# Altium schematic sheet sch1.SchDoc
size A4
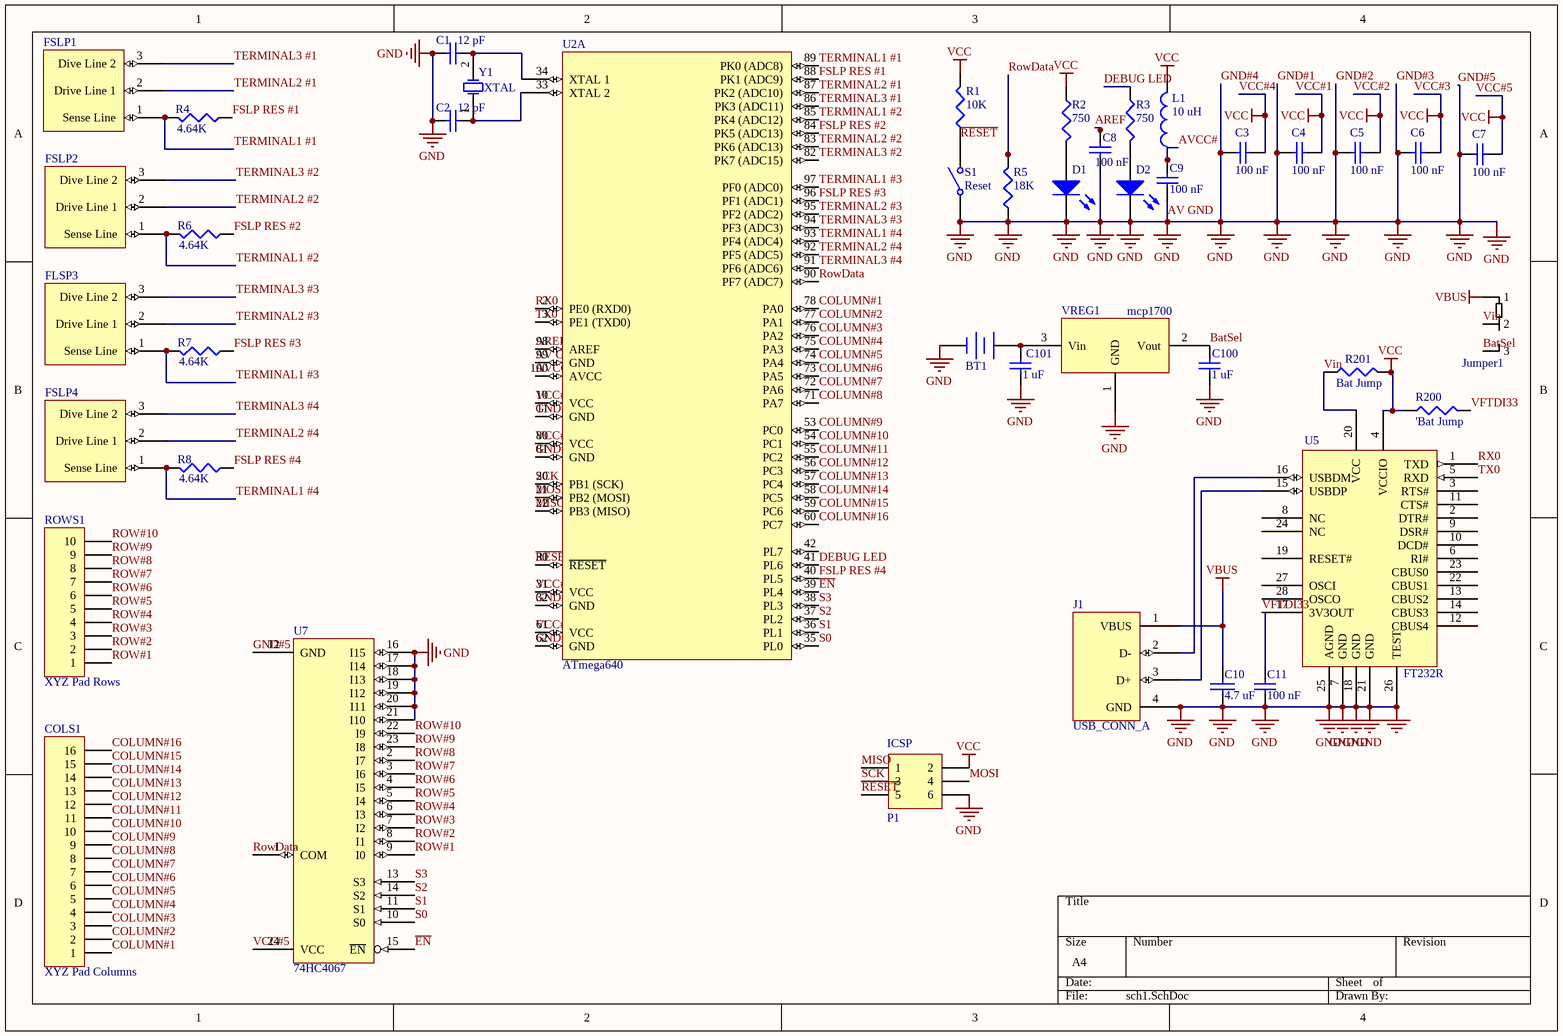
[diagram p0: sch1.SchDoc]

## Parts
BT1  Battery 3.7V Li-Ion  [BAT-2]  (value not drawn)
C1  12 pF  [0805]
C2  12 pF  [0805]
C3  100 nF  [1608[0603]]
C4  100 nF  [1608[0603]]
C5  100 nF  [1608[0603]]
C6  100 nF  [1608[0603]]
C7  100 nF  [1608[0603]]
C8  100 nF  [1608[0603]]
C9  100 nF  [1608[0603]]
C10  4.7 uF  [1608[0603]]
C11  100 nF  [1608[0603]]
C100  1 uF  [0805]
C101  1 uF  [0805]
COLS1  XYZ Pad Columns  [16 pin head]
D1  Power LED  [1608[0603]]  (value not drawn)
D2  Debug LED  [1608[0603]]  (value not drawn)
FLSP3  FSLP  [FSLP SMT connector]  (value not drawn)
FSLP1  FSLP  [FSLP SMT connector]  (value not drawn)
FSLP2  FSLP  [FSLP SMT connector]  (value not drawn)
FSLP4  FSLP  [FSLP SMT connector]  (value not drawn)
J1  USB_CONN_A  [USB_CONN_TYPEA_.9]
Jumper1  0-Ohm Jumper 0603  [0603-Jumper]  (value not drawn)
L1  10 uH  [1608[0603]]
P1  ICSP  [HDR2X3H]
R1  10K  [1608[0603]]
R2  750  [1608[0603]]
R3  750  [1608[0603]]
R4  4.64K  [1608[0603]]
R5  18K  [1608[0603]]
R6  4.64K  [1608[0603]]
R7  4.64K  [1608[0603]]
R8  4.64K  [1608[0603]]
R200  'Bat Jump  [J1-0603]
R201  Bat Jump  [J1-0603]
ROWS1  XYZ Pad Rows  [10 pin Head]
S1  Reset  [B3U-1000P]
U2  ATmega640  [100A_N]  (part A of 2)
U5  FT232R  [SSOP28]
U7  74HC4067  [74HC4067]
VREG1  mcp1700  [SOT-23]
Y1  XTAL  [crystal]

## Nets
AV GND: BT1.2(-) C1.2 C2.2 C3.2 C4.2 C5.2 C6.2 C7.2 C8.1 C9.1 C10.2 C11.1 C100.1 C101.1 D1.2(K) D2.2(K) J1.4(GND) P1.6 R5.1 S1.1(COMMON) U2.11(GND) U2.32(GND) U2.62(GND) U2.81(GND) U2.99(GND) U5.7(GND) U5.18(GND) U5.21(GND) U5.25(AGND) U5.26(TEST) U7.12(GND) U7.16(I15) U7.17(I14) U7.18(I13) U7.19(I12) U7.20(I11) U7.21(I10) VREG1.1(GND)  [also labelled GND, GND#1, GND#2, GND#3, GND#4, GND#5, VSS]
VBUS: C10.1 J1.1(VBUS) Jumper1.1
VCC#1: C3.1 C4.1 C5.1 C6.1 C7.1 L1.2 P1.2 R1.2 R2.1 R200.1 R201.2 U2.10(VCC) U2.31(VCC) U2.61(VCC) U2.80(VCC) U5.4(VCCIO) U7.24(VCC)  [also labelled VCC, VCC#2, VCC#3, VCC#4, VCC#5]
AREF: C8.2 U2.98(AREF)
AVCC#: C9.2 L1.1 U2.100(AVCC)
BatSel: C100.2 Jumper1.3 VREG1.2(Vout)
COLUMN#1: COLS1.1 U2.78(PA0)
COLUMN#2: COLS1.2 U2.77(PA1)
COLUMN#3: COLS1.3 U2.76(PA2)
COLUMN#4: COLS1.4 U2.75(PA3)
COLUMN#5: COLS1.5 U2.74(PA4)
COLUMN#6: COLS1.6 U2.73(PA5)
COLUMN#7: COLS1.7 U2.72(PA6)
COLUMN#8: COLS1.8 U2.71(PA7)
COLUMN#9: COLS1.9 U2.53(PC0)
COLUMN#10: COLS1.10 U2.54(PC1)
COLUMN#11: COLS1.11 U2.55(PC2)
COLUMN#12: COLS1.12 U2.56(PC3)
COLUMN#13: COLS1.13 U2.57(PC4)
COLUMN#14: COLS1.14 U2.58(PC5)
COLUMN#15: COLS1.15 U2.59(PC6)
COLUMN#16: COLS1.16 U2.60(PC7)
DEBUG LED: R3.1 U2.41(PL6)
~{EN}: U2.39(PL4) U7.15(~{EN})
FSLP RES #1: R4.1 U2.88(PK1_(ADC9))
FSLP RES #2: R6.1 U2.84(PK5_(ADC13))
FSLP RES #3: R7.1 U2.96(PF1_(ADC1))
FSLP RES #4: R8.1 U2.40(PL5)
MISO: P1.1 U2.22(PB3_(MISO))
MOSI: P1.4 U2.21(PB2_(MOSI))
~{RESET}: P1.5 R1.1 S1.2(NO) U2.30(~{RESET})
ROW#1: ROWS1.1 U7.9(I0)
ROW#2: ROWS1.2 U7.8(I1)
ROW#3: ROWS1.3 U7.7(I2)
ROW#4: ROWS1.4 U7.6(I3)
ROW#5: ROWS1.5 U7.5(I4)
ROW#6: ROWS1.6 U7.4(I5)
ROW#7: ROWS1.7 U7.3(I6)
ROW#8: ROWS1.8 U7.2(I7)
ROW#9: ROWS1.9 U7.23(I8)
ROW#10: ROWS1.10 U7.22(I9)
RowData: R5.2 U2.90(PF7_(ADC7)) U7.1(COM)
RX0: U2.2(PE0_(RXD0)) U5.1(TXD)
S0: U2.35(PL0) U7.10(S0)
S1: U2.36(PL1) U7.11(S1)
S2: U2.37(PL2) U7.14(S2)
S3: U2.38(PL3) U7.13(S3)
SCK: P1.3 U2.20(PB1_(SCK))
TERMINAL1 #1: FSLP1.1(Sense_Line) R4.2 U2.89(PK0_(ADC8))
TERMINAL1 #2: FSLP2.1(Sense_Line) R6.2 U2.85(PK4_(ADC12))
TERMINAL1 #3: FLSP3.1(Sense_Line) R7.2 U2.97(PF0_(ADC0))
TERMINAL1 #4: FSLP4.1(Sense_Line) R8.2 U2.93(PF4_(ADC4))
TERMINAL2 #1: FSLP1.2(Drive_Line_1) U2.87(PK2_(ADC10))
TERMINAL2 #2: FSLP2.2(Drive_Line_1) U2.83(PK6_(ADC13))
TERMINAL2 #3: FLSP3.2(Drive_Line_1) U2.95(PF2_(ADC2))
TERMINAL2 #4: FSLP4.2(Drive_Line_1) U2.92(PF5_(ADC5))
TERMINAL3 #1: FSLP1.3(Dive_Line_2) U2.86(PK3_(ADC11))
TERMINAL3 #2: FSLP2.3(Dive_Line_2) U2.82(PK7_(ADC15))
TERMINAL3 #3: FLSP3.3(Dive_Line_2) U2.94(PF3_(ADC3))
TERMINAL3 #4: FSLP4.3(Dive_Line_2) U2.91(PF6_(ADC6))
TX0: U2.3(PE1_(TXD0)) U5.5(RXD)
VFTDI33: C11.2 R200.2 U5.17(3V3OUT)
Vin: Jumper1.2 R201.1 U5.20(VCC)
NetBT1_1: BT1.1(+) C101.2 VREG1.3(Vin)
NetC1_1: C1.1 U2.34(XTAL_1) Y1.2(OSC2)
NetC2_1: C2.1 U2.33(XTAL_2) Y1.1(OSC1)
NetD1_1: D1.1(A) R2.2
NetD2_1: D2.1(A) R3.2
NetJ1_2: J1.2(D-) U5.16(USBDM)
NetJ1_3: J1.3(D+) U5.15(USBDP)

Not connected (* = marked no-connect by the designer): U2 42(PL7); U5 2(DTR#) 3(RTS#) 6(RI#) 8(NC) 9(DSR#) 10(DCD#) 11(CTS#) 12(CBUS4) 13(CBUS2) 14(CBUS3) 19(RESET#) 22(CBUS1) 23(CBUS0) 24(NC) 27(OSCI) 28(OSCO)

## Library data of the parts
BT1 = Battery: Multicell Battery; Published: 24-Mar-1999; LatestRevisionDate: 17-Jul-2002; LatestRevisionNote: Re-released for DXP Platform.; Publisher: Altium Limited
C1 C2 = Cap: Capacitor; Part Number: 311-1100-1-ND; Manufacturer: Yageo; Component: XTAL Caps; Supplier: Digikey; Digikey #: CC0805JRNPO9BN120; Unit Price: 0.07
C3-C9 C11 = Cap: Capacitor; Part Number: 311-1088-1-ND; Manufacturer #: CC0603KRX7R7BB104; Manufacturer: Yageo; Component: 0.1UF 16V 10%; Supplier: Digikey; Unit Price: 0.07
C10 = CAP: Capacitor; Part Number: 311-1521-1-ND; Component: 4.7UF 6.3V 10% Decoupling; Supplier: Digikey; Unit Price: 0.11
C100 C101 = Cap: Capacitor
COLS1 = Header 16: Header, 16-Pin; Component: 16 pin header; Unit Price: 0.00
D1 = LED3: Orange; Part Number: 475-2740-1-ND; Manufacturer #: LO L29K-H2K1-24-Z; Component: Orange Power LED 2 mA; Supplier: Digikey; Unit Price: 0.17
D2 = LED3: Orange; Part Number: 475-1196-1-ND; Manufacturer #: LY L29K-H1K2-26-Z; Component: Yellow debug LED 2 mA; Supplier: Digikey; Unit Price: 0.14
FLSP3 FSLP1 FSLP2 FSLP4 = FSLP: Manufacturer: Interlink Electronics; Part Number: 34-00003; Tail connector: 04FM-1.0SP-1.9-TF; Component: Side strip position & pressure sensor; Supplier: Digikey; Unit Price: 8.73
J1 = USB_CONN_A: Connector USB Type A; Component: USB Receptacle
L1 = Inductor: AVCC filter; Part Number: 445-6755-1-ND; Component: 10UH 300MA 600 MOHM Inductor; Supplier: Digikey; Unit Price: 0.12
P1 = Header 3X2H: Header, 3-Pin, Dual row, Right Angle; Component: 2x3 Programmer header
R1 = Res3: Resistor; Part Number: 1276-3485-1-ND; Manufacturer: Samsung Electro-Mechanics America, Inc; Manufacturer Part Number: RC1608F103CS; Component: RES 10K OHM 1/10W 1% 0603; PackageReference: 0603 (1608 Metric); Supplier: Digikey; Unit Price: 0.07
R2 R3 = Res3: Resistor; Part Number: 1276-4635-1-ND; Manufacturer: Samsung Electro-Mechanics America, Inc; Manufacturer Part Number: RC1608F751CS; Component: RES 750 OHM 1/10W 1% 0603; PackageReference: 0603 (1608 Metric); Supplier: Digikey; Unit Price: 0.07
R4 R6-R8 = Res3: Resistor; Part Number: 1276-4709-1-ND; Manufacturer: Samsung Electro-Mechanics America, Inc; Manufacturer Part Number: RC1608F4641CS; Component: 4.64 K Resistor; Name: Ben; PackageReference: 0603 (1608 Metric); Supplier: Digikey; Unit Price: 0.07
R5 = Res3: Resistor; Part Number: 1276-4768-1-ND; Manufacturer: Samsung Electro-Mechanics America, Inc; Manufacturer Part Number: RC1608F203CS; Component: RES 20K OHM 1/10W 1% 0603; PackageReference: 0603 (1608 Metric); Supplier: Digikey; Unit Price: 0.07
R200 R201 = Res3: Resistor
ROWS1 = Header 10: Header, 10-Pin; Component: 10 pin header; Unit Price: 0.00
S1 = SW-SPST: Single-Pole, Single-Throw Switch; Part Number: SW1020CT-ND; Component: B3U-1000P Switch; Supplier: Digikey; Unit Price: 0.86
U2 = ATxmega64A1-AU: 8/16-bit AVR XMEGA A1 Microcontroller, 1.6-3.6V, 64KB + 4KB Flash, 2KB EEPROM, 4KB SRAM, 100-pin TQFP, Industrial Grade (-40°C to 85°C), Pb-Free; Part Number: ATMEGA640-16AURCT-ND; Component: 100A 8-bit AVR uC; PackageDescription: 100-Pin Thin Profile Plastic Quad Flat Pack (TQFP), 14 x 14 x 1.0 mm Body, 0.5 mm Pitch; Supplier: Digikey; Unit Price: 7.92
U5 = FT232R: FT232R - USB UART IC; Component: FTDI USB UART
U7 = MUX-74HC4067: Part Number: 568-2699-5-ND; Manufacturer #: 74HC4067PW,112; Manufacturer: NXP; Component: Row MuX; Supplier: Digikey; Unit Price: 2.02
Y1 = XTAL: Crystal Oscillator; Part Number: 644-1204-1-ND; Component: 7.3278 MHz Clock; Supplier: digikey; Unit Price: 0.44